# EAGLE design G021vrs (EAGLE 6.6.0)
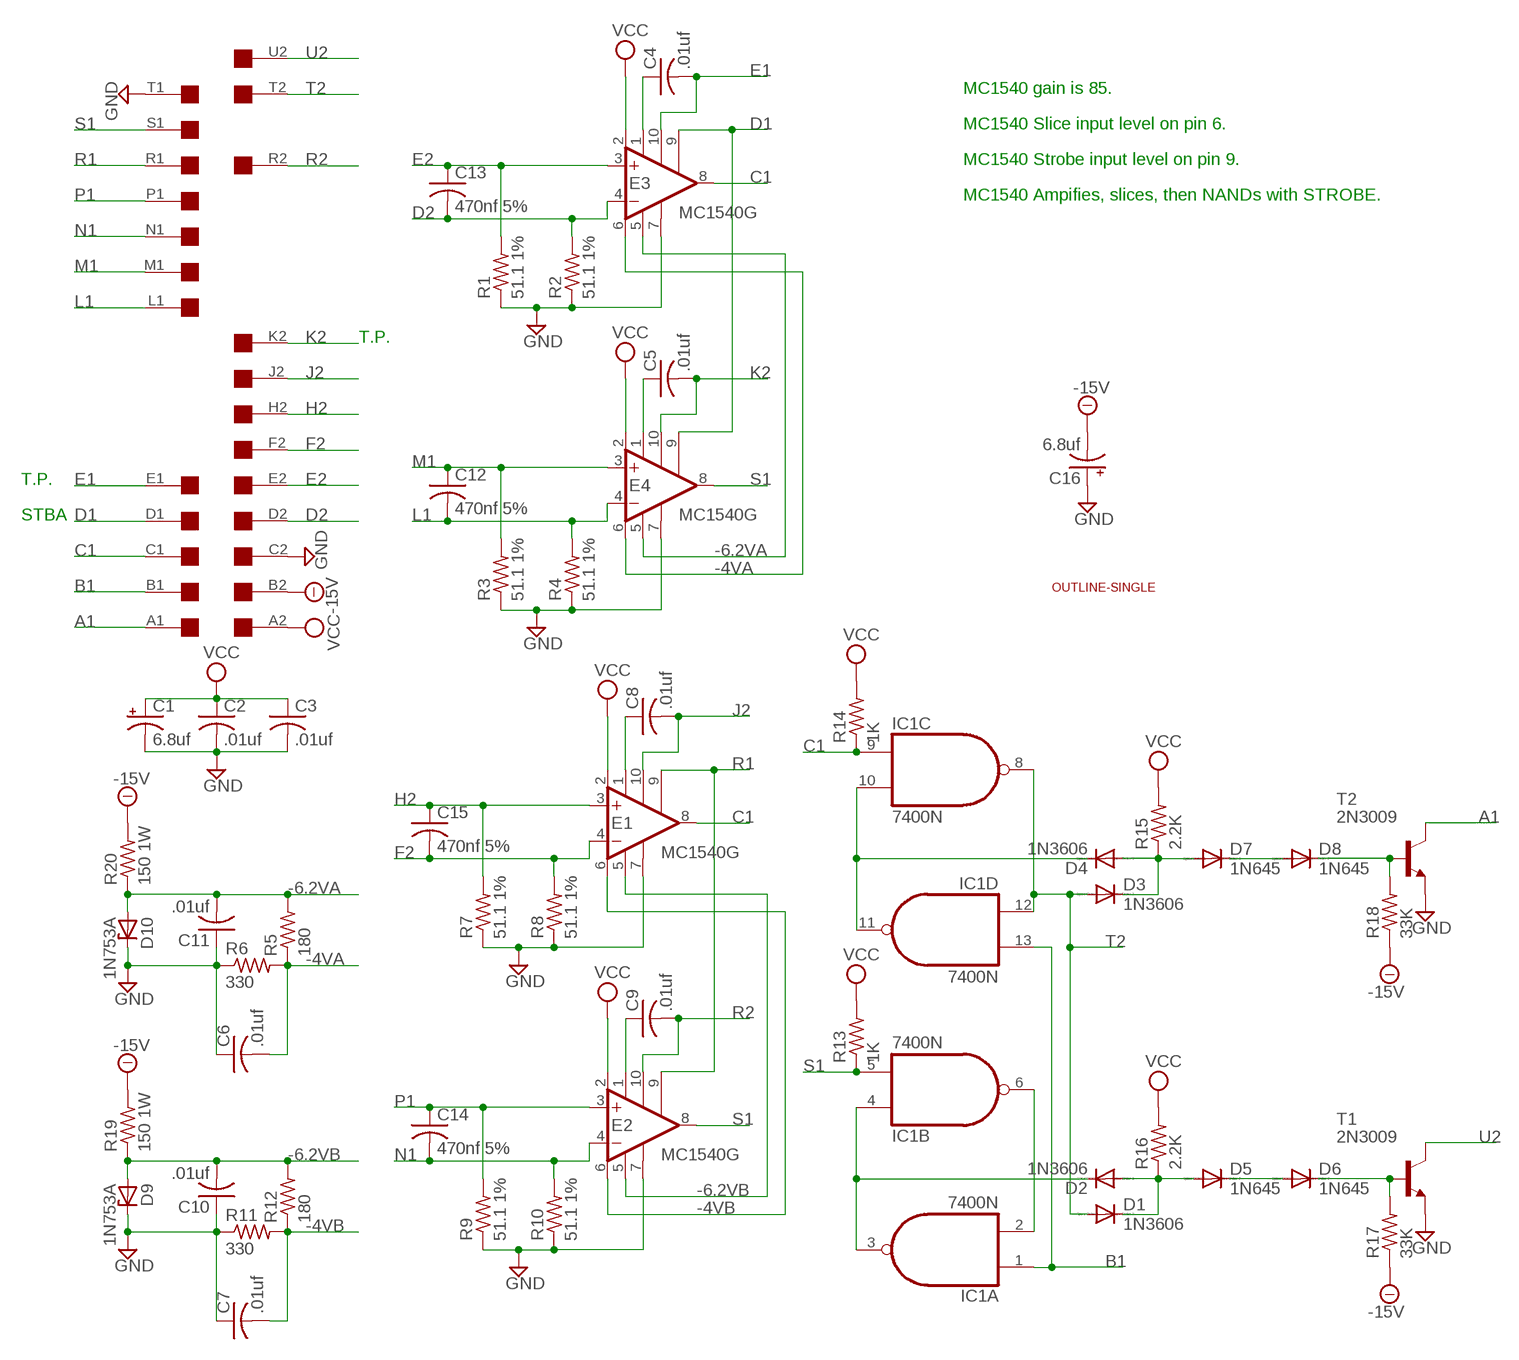
[diagram p0: schematic, sheet 1]

## Parts
C1  6.8uf  CPOL-USE15-5AXIAL  [E15-5]
C2  .01uf  C-US050-025X075  [C050-025X075]
C3  .01uf  C-US050-025X075  [C050-025X075]
C4  .01uf  C-US050-025X075  [C050-025X075]
C5  .01uf  C-US050-025X075  [C050-025X075]
C6  .01uf  C-US050-025X075  [C050-025X075]
C7  .01uf  C-US050-025X075  [C050-025X075]
C8  .01uf  C-US050-025X075  [C050-025X075]
C9  .01uf  C-US050-025X075  [C050-025X075]
C10  .01uf  C-US050-025X075  [C050-025X075]
C11  .01uf  C-US050-025X075  [C050-025X075]
C12  470nf 5%  C-US050-025X075  [C050-025X075]
C13  470nf 5%  C-US050-025X075  [C050-025X075]
C14  470nf 5%  C-US050-025X075  [C050-025X075]
C15  470nf 5%  C-US050-025X075  [C050-025X075]
C16  6.8uf  CPOL-USE15-5AXIAL  [E15-5]
D1  1N3606  1N4148DO35-10  [DO35-10]
D2  1N3606  1N4148DO35-10  [DO35-10]
D3  1N3606  1N4148DO35-10  [DO35-10]
D4  1N3606  1N4148DO35-10  [DO35-10]
D5  1N645  1N4148DO35-10  [DO35-10]
D6  1N645  1N4148DO35-10  [DO35-10]
D7  1N645  1N4148DO35-10  [DO35-10]
D8  1N645  1N4148DO35-10  [DO35-10]
D9  1N753A  ZENER-DIODEF126-10  [F126Z10]
D10  1N753A  ZENER-DIODEF126-10  [F126Z10]
E1  MC1540G  [602B]
E2  MC1540G  [602B]
E3  MC1540G  [602B]
E4  MC1540G  [602B]
IC1  7400N  [DIL14]
R1  51.1 1%  R-US_0207/10  [0207/10]
R2  51.1 1%  R-US_0207/10  [0207/10]
R3  51.1 1%  R-US_0207/10  [0207/10]
R4  51.1 1%  R-US_0207/10  [0207/10]
R5  180  R-US_0207/10  [0207/10]
R6  330  R-US_0207/10  [0207/10]
R7  51.1 1%  R-US_0207/10  [0207/10]
R8  51.1 1%  R-US_0207/10  [0207/10]
R9  51.1 1%  R-US_0207/10  [0207/10]
R10  51.1 1%  R-US_0207/10  [0207/10]
R11  330  R-US_0207/10  [0207/10]
R12  180  R-US_0207/10  [0207/10]
R13  1K  R-US_0207/10  [0207/10]
R14  1K  R-US_0207/10  [0207/10]
R15  2.2K  R-US_0207/10  [0207/10]
R16  2.2K  R-US_0207/10  [0207/10]
R17  33K  R-US_0207/10  [0207/10]
R18  33K  R-US_0207/10  [0207/10]
R19  150 1W  R-US_0414/15  [0414/15]
R20  150 1W  R-US_0414/15  [0414/15]
T1  2N3009  2N3565  [TO92]
T2  2N3009  2N3565  [TO92]
U$1  SINGLE  [EDGE-CON2]
U$2  OUTLINE-SINGLE  [SINGLE]

## Nets
-4VA: C6.2 E3.6(SLICE) E4.6(SLICE) R5.1 R6.2
-4VB: C7.2 E1.6(SLICE) E2.6(SLICE) R11.2 R12.1
-6.2VA: C11.2 D10.A E3.5(V-) E4.5(V-) R5.2 R20.1
-6.2VB: C10.2 D9.A E1.5(V-) E2.5(V-) R12.2 R19.1
-15V: C16.- R17.1 R18.1 R19.2 R20.2 U$1.B2
A1: T2.1(C) U$1.A1
B1: IC1.1(A:I0) IC1.13(D:I1) U$1.B1
C1: E1.8(OUT) E3.8(OUT) IC1.9(C:I0) R14.1 U$1.C1
D1: E3.9(ISTROBE) E4.9(ISTROBE) U$1.D1
D2: C13.2 E3.4(-IN) R2.2 U$1.D2
E1: C4.2 E3.10(CEXTB) U$1.E1
E2: C13.1 E3.3(+IN) R1.2 U$1.E2
F2: C15.2 E1.4(-IN) R8.2 U$1.F2
GND [supply]: C1.- C2.2 C3.2 C6.1 C7.1 C10.1 C11.1 C16.+ D9.C D10.C E1.7(GND) E2.7(GND) E3.7(GND) E4.7(GND) R1.1 R2.1 R3.1 R4.1 R6.1 R7.1 R8.1 R9.1 R10.1 R11.1 T1.3(E) T2.3(E) U$1.C2 U$1.T1
H2: C15.1 E1.3(+IN) R7.2 U$1.H2
J2: C8.2 E1.10(CEXTB) U$1.J2
K2: C5.2 E4.10(CEXTB) U$1.K2
L1: C12.2 E4.4(-IN) R4.2 U$1.L1
M1: C12.1 E4.3(+IN) R3.2 U$1.M1
N1: C14.2 E2.4(-IN) R10.2 U$1.N1
N$1: C4.1 E3.1(CEXTA)
N$2: C8.1 E1.1(CEXTA)
N$3: C5.1 E4.1(CEXTA)
N$4: C9.1 E2.1(CEXTA)
N$6: D1.C D2.A D5.A R16.1
N$7: D4.C IC1.10(C:I1) IC1.11(D:O)
N$8: D2.C IC1.3(A:O) IC1.4(B:I0)
N$9: IC1.2(A:I1) IC1.6(B:O)
N$10: D3.C D4.A D7.A R15.1
N$11: D7.C D8.A
N$12: D5.C D6.A
N$13: D8.C R18.2 T2.2(B)
N$14: D6.C R17.2 T1.2(B)
P1: C14.1 E2.3(+IN) R9.2 U$1.P1
R1: E1.9(ISTROBE) E2.9(ISTROBE) U$1.R1
R2: C9.2 E2.10(CEXTB) U$1.R2
S1: E2.8(OUT) E4.8(OUT) IC1.5(B:I1) R13.1 U$1.S1
T2: D1.A D3.A IC1.8(C:O) IC1.12(D:I0) U$1.T2
U2: T1.1(C) U$1.U2
VCC [supply]: C1.+ C2.1 C3.1 E1.2(V+) E2.2(V+) E3.2(V+) E4.2(V+) R13.2 R14.2 R15.2 R16.2 U$1.A2
Unconnected: U$1.F1 U$1.H1 U$1.J1 U$1.K1 U$1.L2 U$1.M2 U$1.N2 U$1.P2 U$1.S2 U$1.U1 U$1.V1 U$1.V2

## Notes on the sheet
- MC1540 gain is 85.
- MC1540 Slice input level on pin 6.
- MC1540 Strobe input level on pin 9.
- MC1540 Ampifies, slices, then NANDs with STROBE.
- T.P.
- T.P.
- STBA

## Power pins joined to a net without a drawn wire
GND: IC1.7(P:GND)
VCC: IC1.14(P:VCC)

## Library data of the parts
C1 C16 = rcl:CPOL-US: POLARIZED CAPACITOR, American symbol
C2-C15 = rcl:C-US: CAPACITOR, American symbol
D1-D8 = diode:1N4148: DIODE high speed (Philips)
D9 D10 = diode:ZENER-DIODE: Z-Diode
E1-E4 = dec-con:MC1540: OP AMP
IC1 = 74xx-us:74*00: Quad 2-input NAND gate
R1-R20 = rcl:R-US_: RESISTOR, American symbol
T1 T2 = transistor:2N3565: NPN TRANSISTOR
U$1 = dec-con:SINGLE: Single-Height DEC board
U$2 = dec-con:OUTLINE-*: Board outlines for DEC boards.

## Net classes
1 supply: width 0.762 mm, clearance 0.635 mm

## Board
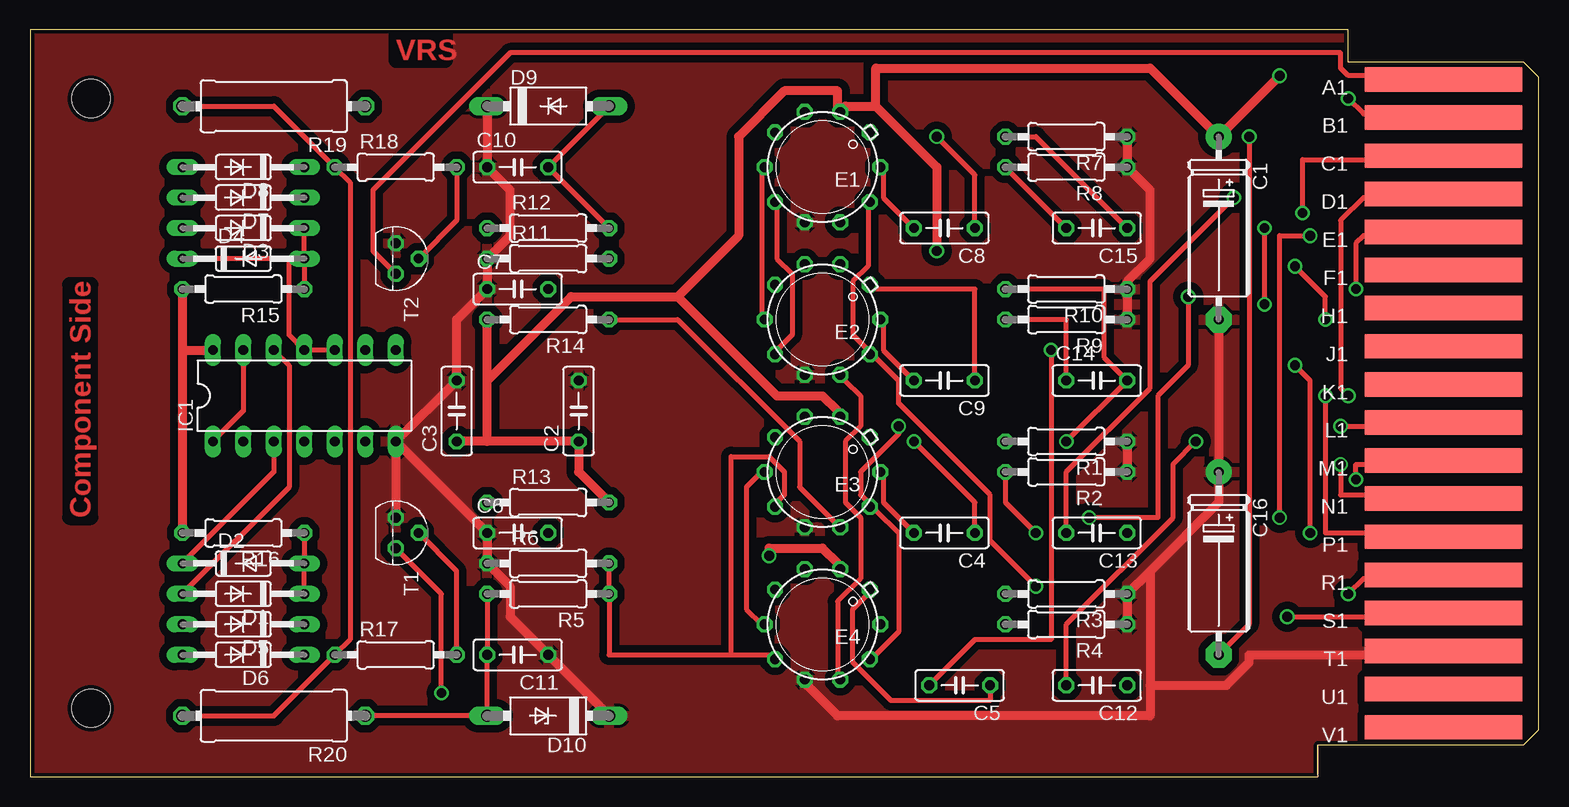
[diagram p1: board, top side]
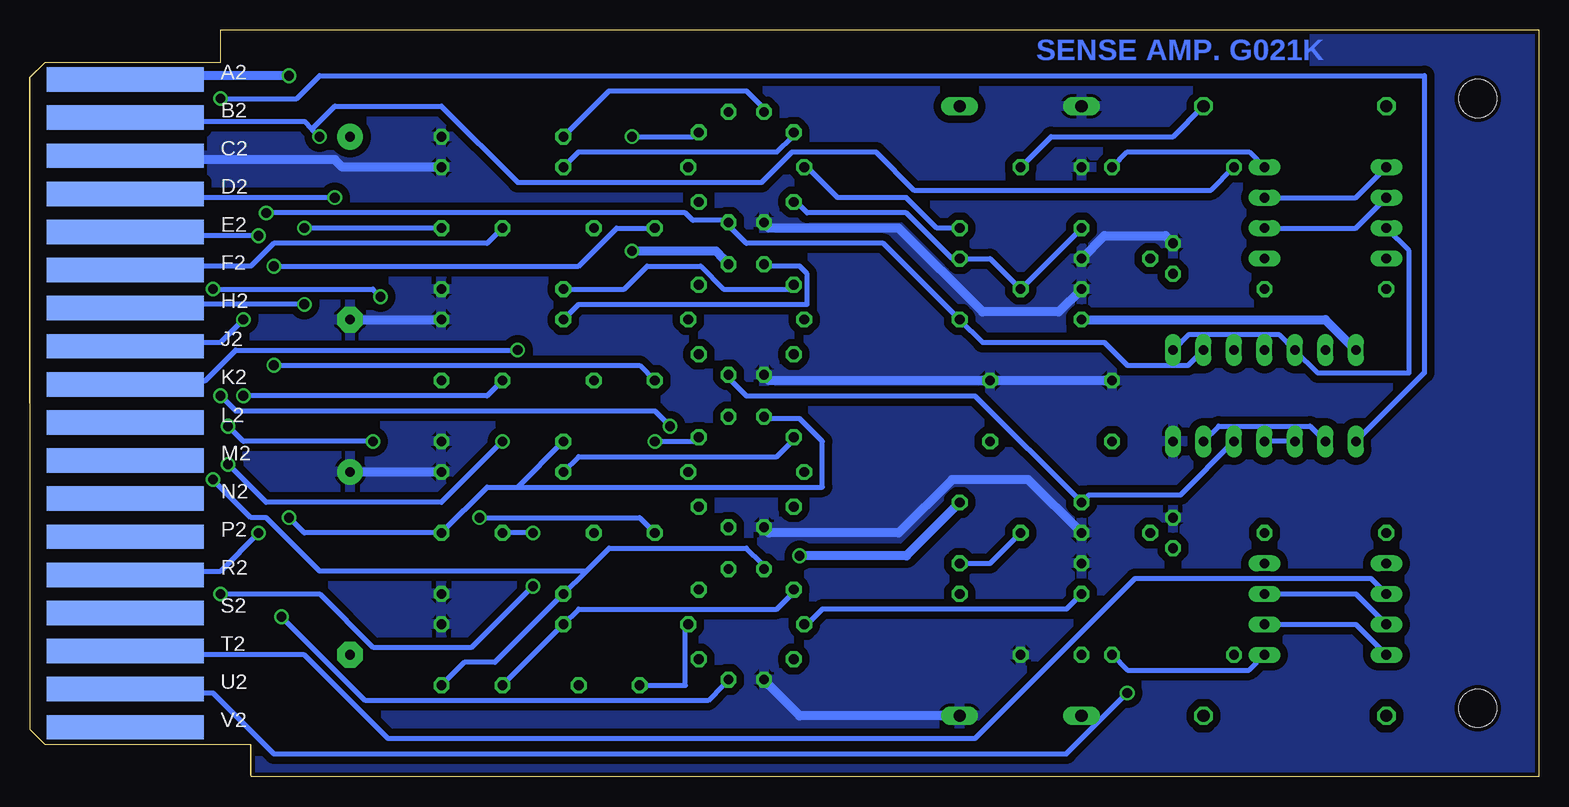
[diagram p2: board, bottom side, seen from below]

Size 125.73 x 62.23 mm. Coordinates in mm from the lower left corner, seen from the top.
Copper layers (1+16): Top 0.035mm / dielectric 1.5mm / Bottom 0.035mm
Design rules "16mils": minimum track width 16mil, minimum drill 32mil, track to track 15mil, track to pad 10mil, pad to pad 10mil, via to via 10mil, smd to smd 10mil, copper to edge 13mil, drill to drill 10mil, minimum pad ring 10mil, minimum via ring 8mil, stop-mask expansion 0mil, vias tented up to drill 0mil, thermal gap 10mil

### Footprints (pad centres in the part's own frame; a part is rotated, then mirrored left to right if it is on the bottom)
E15-5 = drill 0.813 pad 2.159: + -7.62,0 | drill 0.813 pad 2.159 octagon: - 7.62,0
C050-025X075 = drill 0.813 octagon: 1 -2.54,0; 2 2.54,0
DO35-10 = drill 0.813 long: A 5.08,0; C -5.08,0
F126Z10 = drill 1.016 long: A 5.08,0; C -5.08,0
602B = drill 0.813 octagon: 1 -3.954,-2.897; 2 -1.478,-4.605; 3 1.478,-4.605; 4 3.954,-2.897; 5 4.825,0; 6 3.954,2.897; 7 1.478,4.605; 8 -1.477,4.605; 9 -3.954,2.897; 10 -4.825,0
DIL14 = drill 0.813 long: 1 -7.62,-3.81; 2 -5.08,-3.81; 3 -2.54,-3.81; 4 0,-3.81; 5 2.54,-3.81; 6 5.08,-3.81; 7 7.62,-3.81; 8 7.62,3.81; 9 5.08,3.81; 10 2.54,3.81; 11 0,3.81; 12 -2.54,3.81; 13 -5.08,3.81; 14 -7.62,3.81
0207/10 = drill 0.813 octagon: 1 -5.08,0; 2 5.08,0
0414/15 = drill 1.016 octagon: 1 -7.62,0; 2 7.62,0
TO92 = drill 0.813 octagon: 1 1.27,0; 2 0,1.905; 3 -1.27,0
EDGE-CON2 = smd 13.106 x 2.032: A1 7.938,4.128; B1 7.938,7.303; C1 7.938,10.477; D1 7.938,13.652; E1 7.938,16.828; F1 7.938,20.003; H1 7.938,23.177; J1 7.938,26.352; K1 7.938,29.527; L1 7.938,32.703; M1 7.938,35.877; N1 7.938,39.053; P1 7.938,42.227; R1 7.938,45.403; S1 7.938,48.578; T1 7.938,51.752; U1 7.938,54.928; V1 7.938,58.102 | smd 13.106 x 2.032 bottom: A2 7.938,4.128; B2 7.938,7.303; C2 7.938,10.477; D2 7.938,13.652; E2 7.938,16.828; F2 7.938,20.003; H2 7.938,23.177; J2 7.938,26.352; K2 7.938,29.527; L2 7.938,32.703; M2 7.938,35.877; N2 7.938,39.053; P2 7.938,42.227; R2 7.938,45.403; S2 7.938,48.578; T2 7.938,51.752; U2 7.938,54.928; V2 7.938,58.102
SINGLE = hole 3.175: 120.65,56.515; 120.65,5.715

### Placement (x,y rotation side)
C1  99.06,45.72 270 top
C2  45.72,30.48 90 top
C3  35.56,30.48 90 top
C4  76.2,20.32 180 top
C5  77.47,7.62 180 top
C6  40.64,20.32 0 top
C7  40.64,40.64 0 top
C8  76.2,45.72 180 top
C9  76.2,33.02 180 top
C10  40.64,50.8 0 top
C11  40.64,10.16 180 top
C12  88.9,7.62 180 top
C13  88.9,20.32 180 top
C14  88.9,33.02 0 top
C15  88.9,45.72 180 top
C16  99.06,17.78 270 top
D1  17.78,15.24 180 top
D2  17.78,17.78 0 top
D3  17.78,45.72 180 top
D4  17.78,43.18 0 top
D5  17.78,12.7 180 top
D6  17.78,10.16 180 top
D7  17.78,48.26 180 top
D8  17.78,50.8 180 top
D9  43.18,55.88 0 top
D10  43.18,5.08 180 top
E1  66.04,50.8 180 top
E2  66.04,38.1 180 top
E3  66.04,25.4 180 top
E4  66.04,12.7 180 top
IC1  22.86,31.75 0 top
R1  86.36,27.94 180 top
R2  86.36,25.4 180 top
R3  86.36,15.24 180 top
R4  86.36,12.7 180 top
R5  43.18,15.24 180 top
R6  43.18,17.78 0 top
R7  86.36,53.34 180 top
R8  86.36,50.8 180 top
R9  86.36,38.1 180 top
R10  86.36,40.64 180 top
R11  43.18,43.18 0 top
R12  43.18,45.72 0 top
R13  43.18,22.86 0 top
R14  43.18,38.1 180 top
R15  17.78,40.64 180 top
R16  17.78,20.32 180 top
R17  30.48,10.16 0 top
R18  30.48,50.8 0 top
R19  20.32,55.88 180 top
R20  20.32,5.08 180 top
T1  30.48,20.32 270 top
T2  30.48,43.18 270 top
U$1  125.73,62.23 180 top
U$2  125.73,62.23 180 top

### Tracks (layer width: path | path; a pad name or v marks a point on that pad's centre or on a via)
-4VA
  Top 0.406: 58.42,10.16 48.26,10.16 R5.1 R6.2 | 58.42,10.16 61.59,10.16 E4.6 | 58.42,10.16 58.42,26.67 61.59,26.67 62.87,25.4 62.87,23.5 62.23,22.86 E3.6
  Bottom 0.406: C6.2 45.72,17.78 R6.2
-4VB
  Top 0.406: E2.6 62.23,35.56 63.5,36.83 63.5,41.91 62.23,43.18 62.23,47.62 E1.6
  Bottom 0.406: R12.1 C7.2 45.72,43.18 R11.2 48.9,43.18 52.7,46.99 60.96,46.99 61.59,47.62 E1.6
-6.2VA
  Top 0.406: E4.5 60.96,12.7 59.69,13.97 59.69,24.13 60.96,25.4 E3.5 | R5.2 C11.2 D10.A R20.1
  Bottom 0.406: R5.2 39.37,13.97 59.69,13.97 60.96,12.7 E4.5
-6.2VB
  Top 0.406: E2.5 60.96,38.1 60.96,50.8 E1.5 | R12.2 C10.2 D9.A
  Bottom 0.406: R19.1 30.48,53.34 40.64,53.34 C10.2 | R12.2 50.16,45.72 52.7,48.26 58.42,48.26 60.96,50.8 E1.5
-15V  (via drill 0.81)
  Top 0.406: R20.2 20.32,5.08 R17.1 26.67,11.43 26.67,49.53 R18.1 20.32,55.88 R19.2 | C16.- 101.6,12.7 v101.6,53.34
  Bottom 0.406: 102.23,53.98 102.87,54.61 117.47,54.61 U$1.B2 | 102.23,53.98 v101.6,53.34 | R18.1 27.3,48.9 52.07,48.9 55.24,52.07 62.23,52.07 64.77,49.53 85.09,49.53 91.44,55.88 100.33,55.88 102.23,53.98
A1
  Top 0.406: T2.1 28.57,43.81 28.57,48.9 40.01,60.33 109.22,60.33 109.22,59.05 109.86,58.42 117.47,58.42 U$1.A1
B1  (via drill 0.81)
  Top 0.406: IC1.1 17.78,30.48 IC1.13 | v109.86,56.52 111.12,55.24 117.47,55.24 U$1.B1
  Bottom 0.406: IC1.1 9.53,33.66 9.53,58.42 101.6,58.42 103.5,56.52 v109.86,56.52
C1  (via drill 0.81)
  Top 0.406: R14.1 53.98,38.1 64.14,27.94 64.14,24.13 67.31,20.95 E3.8 | v106.05,46.99 106.05,51.44 117.47,51.44 U$1.C1
  Bottom 0.406: IC1.9 29.21,34.29 34.29,34.29 36.2,36.2 46.35,36.2 R14.1 54.61,44.45 66.04,44.45 67.31,45.72 E1.8 67.94,46.35 70.48,46.35 71.12,46.99 v106.05,46.99
D1  (via drill 0.81)
  Top 0.406: E4.9 70.48,10.16 72.39,12.06 72.39,20.32 70.48,22.23 E3.9 69.85,22.86 69.22,23.5 69.22,25.4 72.39,28.57 v72.39,29.21 | v109.86,31.75 109.22,32.38 109.22,46.35 111.12,48.26 117.47,48.26 U$1.D1
  Bottom 0.406: v72.39,29.21 73.66,30.48 108.58,30.48 v109.86,31.75
D2  (via drill 0.81)
  Top 0.406: v83.82,20.32 81.28,22.86 R2.2 | v100.33,48.26 93.34,41.27 93.34,32.38 86.36,25.4 C13.2
  Bottom 0.406: R2.2 80.01,26.67 63.5,26.67 62.23,27.94 E3.4 | v83.82,20.32 C13.2 | v100.33,48.26 117.47,48.26 U$1.D2
E1  (via drill 0.81)
  Top 0.406: C4.2 71.12,22.86 71.12,25.4 E3.10 | v88.27,21.59 93.98,21.59 93.98,31.75 96.52,34.29 v96.52,40.01 | v110.49,40.64 110.49,44.45 111.12,45.09 117.47,45.09 U$1.E1
  Bottom 0.406: C4.2 74.93,21.59 v88.27,21.59 | v96.52,40.01 97.16,40.64 v110.49,40.64
E2  (via drill 0.81)
  Top 0.406: v106.68,45.09 104.14,45.09 v104.14,21.59
  Bottom 0.406: 85.09,24.13 87.63,24.13 C13.1 102.87,20.32 v104.14,21.59 | 85.09,24.13 59.69,24.13 59.69,27.94 61.59,29.84 64.14,29.84 E3.3 | 85.09,24.13 R1.2 | v106.68,45.09 117.47,45.09 U$1.E2
F2
  Top 0.406: R8.2 C15.2
  Bottom 0.406: R8.2 80.01,52.07 63.5,52.07 62.23,53.34 E1.4 | C15.2 87.63,44.45 105.41,44.45 107.31,42.55 117.47,42.55 U$1.F2
GND
  Top 0.762: D9.C C10.1 40.01,48.9 40.01,45.09 R11.1 C7.1 35.56,38.1 C3.2 IC1.7 | D10.C C11.1 40.01,13.34 40.01,15.88 R6.1 C6.1 IC1.7 | IC1.7 T1.3 | R1.1 R2.1 | R4.1 R3.1 93.34,17.14 | 93.34,17.14 99.06,22.86 C16.+ C1.- | R7.1 R8.1 93.34,48.9 93.34,43.18 91.44,41.27 R10.1 R9.1 | 93.34,7.62 99.69,7.62 101.6,9.53 101.6,10.16 117.47,10.16 U$1.T1 | 93.34,17.14 93.34,7.62 | 93.34,7.62 93.34,5.08 67.31,5.08 64.77,7.62 E4.7
  Bottom 0.762: T2.3 31.11,45.09 36.2,45.09 R11.1 | C7.1 40.01,38.73 46.35,38.73 53.34,45.72 64.14,45.72 E1.7 | D10.C 61.59,5.08 64.14,7.62 E4.7 | C6.1 42.55,24.77 48.9,24.77 53.34,20.32 64.14,20.32 E3.7 | C3.2 C2.2 64.14,33.02 E2.7 | C16.+ R2.1 | C1.- R9.1 | R8.1 99.69,50.8 100.33,51.44 117.47,51.44 U$1.C2
  pour Bottom: 0,62.23 111.76,62.23 111.76,0 0,0
  pour Top: 0,62.23 111.76,62.23 111.76,0 0,0
H2  (via drill 0.81)
  Top 0.406: C15.1 83.82,53.34 R7.2 | v102.87,45.72 v102.87,39.37
  Bottom 0.406: R7.2 77.47,57.15 66.04,57.15 64.77,55.88 E1.3 | v102.87,39.37 117.47,39.37 U$1.H2 | C15.1 v102.87,45.72
J2  (via drill 0.81)
  Top 0.406: C8.2 71.12,48.26 71.12,50.8 E1.10 | v105.41,42.55 107.95,40.01 v107.95,38.1
  Bottom 0.406: C8.2 76.83,45.72 80.01,42.55 v105.41,42.55 | v107.95,38.1 109.86,36.2 117.47,36.2 U$1.J2
K2  (via drill 0.81)
  Top 0.406: C5.2 78.74,11.43 85.09,11.43 v85.09,35.56
  Bottom 0.406: C5.2 71.12,7.62 71.12,12.7 E4.10 | v85.09,35.56 108.58,35.56 111.12,33.02 117.47,33.02 U$1.K2
L1  (via drill 0.81)
  Top 0.406: v109.22,29.21 117.47,29.21 U$1.L1 | v97.16,27.94 95.25,26.04 95.25,21.59 86.36,12.7 C12.2
  Bottom 0.406: C12.2 R4.2 80.01,13.97 63.5,13.97 62.23,15.24 E4.4 | v109.22,29.21 107.95,27.94 v97.16,27.94
M1  (via drill 0.81)
  Top 0.406: v110.49,24.77 110.49,26.04 117.47,26.04 U$1.M1
  Bottom 0.406: C12.1 89.53,9.53 87,9.53 R3.2 79.38,17.14 | 79.38,17.14 77.47,19.05 66.04,19.05 64.77,17.78 E4.3 | v110.49,24.77 107.31,21.59 106.05,21.59 101.6,17.14 79.38,17.14
N1  (via drill 0.81)
  Top 0.406: R10.2 89.53,40.64 89.53,34.92 C14.2 v86.36,27.94 | v109.22,26.04 109.22,23.5 117.47,23.5 U$1.N1
  Bottom 0.406: R10.2 76.2,40.64 74.3,42.55 69.85,42.55 67.94,40.64 62.23,40.64 E2.4 | v109.22,26.04 106.05,22.86 91.44,22.86 v86.36,27.94
N$1  (via drill 0.81)
  Top 0.406: v73.66,27.94 78.74,22.86 C4.1
  Bottom 0.406: v73.66,27.94 70.48,27.94 E3.1
N$2  (via drill 0.81)
  Top 0.406: v75.56,53.34 78.74,50.16 C8.1
  Bottom 0.406: v75.56,53.34 70.48,53.34 E1.1
N$3
  Top 0.406: C5.1 80.01,6.35 71.75,6.35 68.58,9.53 68.58,13.97 69.85,15.24 E4.1
N$4
  Top 0.406: C9.1 78.74,40.64 70.48,40.64 E2.1
N$6
  Top 0.406: R16.1 D2.A D1.C
  Bottom 0.406: D5.A 15.24,15.24 D1.C
N$7
  Top 0.406: IC1.10 IC1.11 21.59,36.83 21.59,43.18 D4.C
N$8
  Top 0.406: D2.C 20.32,25.4 IC1.3
  Bottom 0.406: IC1.3 IC1.4
N$9
  Bottom 0.406: IC1.2 19.05,29.21 26.67,29.21 IC1.6
N$10
  Top 0.406: R15.1 D4.A D3.C
  Bottom 0.406: D7.A 15.24,45.72 D3.C
N$11
  Bottom 0.406: D8.A 15.24,48.26 D7.C
N$12
  Bottom 0.406: D6.A 15.24,12.7 D5.C
N$13
  Top 0.406: T2.2 35.56,46.35 R18.2
  Bottom 0.406: D8.C 24.13,52.07 34.29,52.07 R18.2
N$14
  Top 0.406: T1.2 35.56,17.14 R17.2
  Bottom 0.406: D6.C 24.13,8.89 34.29,8.89 R17.2
P1  (via drill 0.81)
  Top 0.406: R9.2 86.36,38.1 C14.1 | v107.95,31.75 107.95,20.32 117.47,20.32 U$1.P1
  Bottom 0.406: R9.2 80.01,39.37 60.96,39.37 60.96,41.91 61.59,42.55 64.14,42.55 E2.3 | v107.95,31.75 87.63,31.75 C14.1
R1  (via drill 0.81)
  Top 0.406: E1.9 69.85,47.62 69.85,42.55 68.58,41.27 68.58,36.83 69.85,35.56 E2.9 70.48,34.92 72.39,33.02 72.39,31.11 80.01,23.5 80.01,19.68 v83.82,15.88 | v109.86,15.24 111.12,16.51 117.47,16.51 U$1.R1
  Bottom 0.406: v83.82,15.88 88.9,10.79 97.16,10.79 101.6,15.24 v109.86,15.24
R2  (via drill 0.81)
  Top 0.406: C9.2 71.12,35.56 71.12,38.1 E2.10 | v105.41,34.29 106.68,33.02 v106.68,20.32
  Bottom 0.406: C9.2 74.93,34.29 v105.41,34.29 | v106.68,20.32 109.86,17.14 117.47,17.14 U$1.R2
S1  (via drill 0.81)
  Top 0.406: E4.8 67.31,8.26 67.31,14.61 69.22,16.51 69.22,21.59 67.94,22.86 67.94,27.94 69.22,29.21 69.22,31.75 67.94,33.02 E2.8 | v104.78,13.34 117.47,13.34 U$1.S1
  Bottom 0.406: IC1.5 29.84,23.5 37.47,23.5 R13.1 46.99,31.75 66.04,31.75 67.31,33.02 E2.8 | v104.78,13.34 97.79,6.35 69.22,6.35 67.94,7.62 E4.8
T2
  Top 0.406: D1.A 21.59,24.13 21.59,34.29 IC1.12
  Bottom 0.406: IC1.8 29.21,36.83 21.59,36.83 IC1.12 18.41,33.66 10.79,33.66 10.79,43.81 D3.A | D1.A 13.97,16.51 33.66,16.51 46.99,3.17 95.89,3.17 102.87,10.16 117.47,10.16 U$1.T2
U2  (via drill 0.81)
  Top 0.406: T1.1 34.29,15.24 v34.29,6.99
  Bottom 0.406: v34.29,6.99 39.37,1.91 105.41,1.91 110.49,6.99 117.47,6.99 U$1.U2
VCC  (via drill 0.81)
  Top 0.762: R15.2 12.7,35.56 | 12.7,35.56 R16.2 | 12.7,35.56 IC1.14 | 38.1,27.94 C2.1 45.72,25.4 R13.2 | 38.1,27.94 C3.1 | 38.1,27.94 38.1,33.02 | 38.1,33.02 R14.2 | v61.59,18.41 61.59,19.05 66.04,19.05 67.31,17.78 E4.2 | 53.98,40.01 62.23,31.75 66.04,31.75 67.31,30.48 E3.2 | 53.98,40.01 45.09,40.01 38.1,33.02 | v75.56,43.81 75.56,50.8 70.48,55.88 | 70.48,55.88 67.94,55.88 E1.2 67.31,55.88 67.31,57.15 62.87,57.15 59.05,53.34 59.05,45.09 53.98,40.01 | 70.48,55.88 70.48,59.05 93.34,59.05 C1.+ v104.14,58.42
  Bottom 0.762: v61.59,18.41 52.7,18.41 R13.2 | IC1.14 17.78,38.1 R14.2 | v75.56,43.81 68.58,43.81 67.94,43.18 E2.2 | v104.14,58.42 117.47,58.42 U$1.A2

### Text on the board
Top: VRS | Component Side
Bottom: SENSE AMP. G021K